# Altium schematic sheet lcd_breakout.SchDoc: Lamp Controller
size A4; SheetNumber: 1; SheetTotal: 1
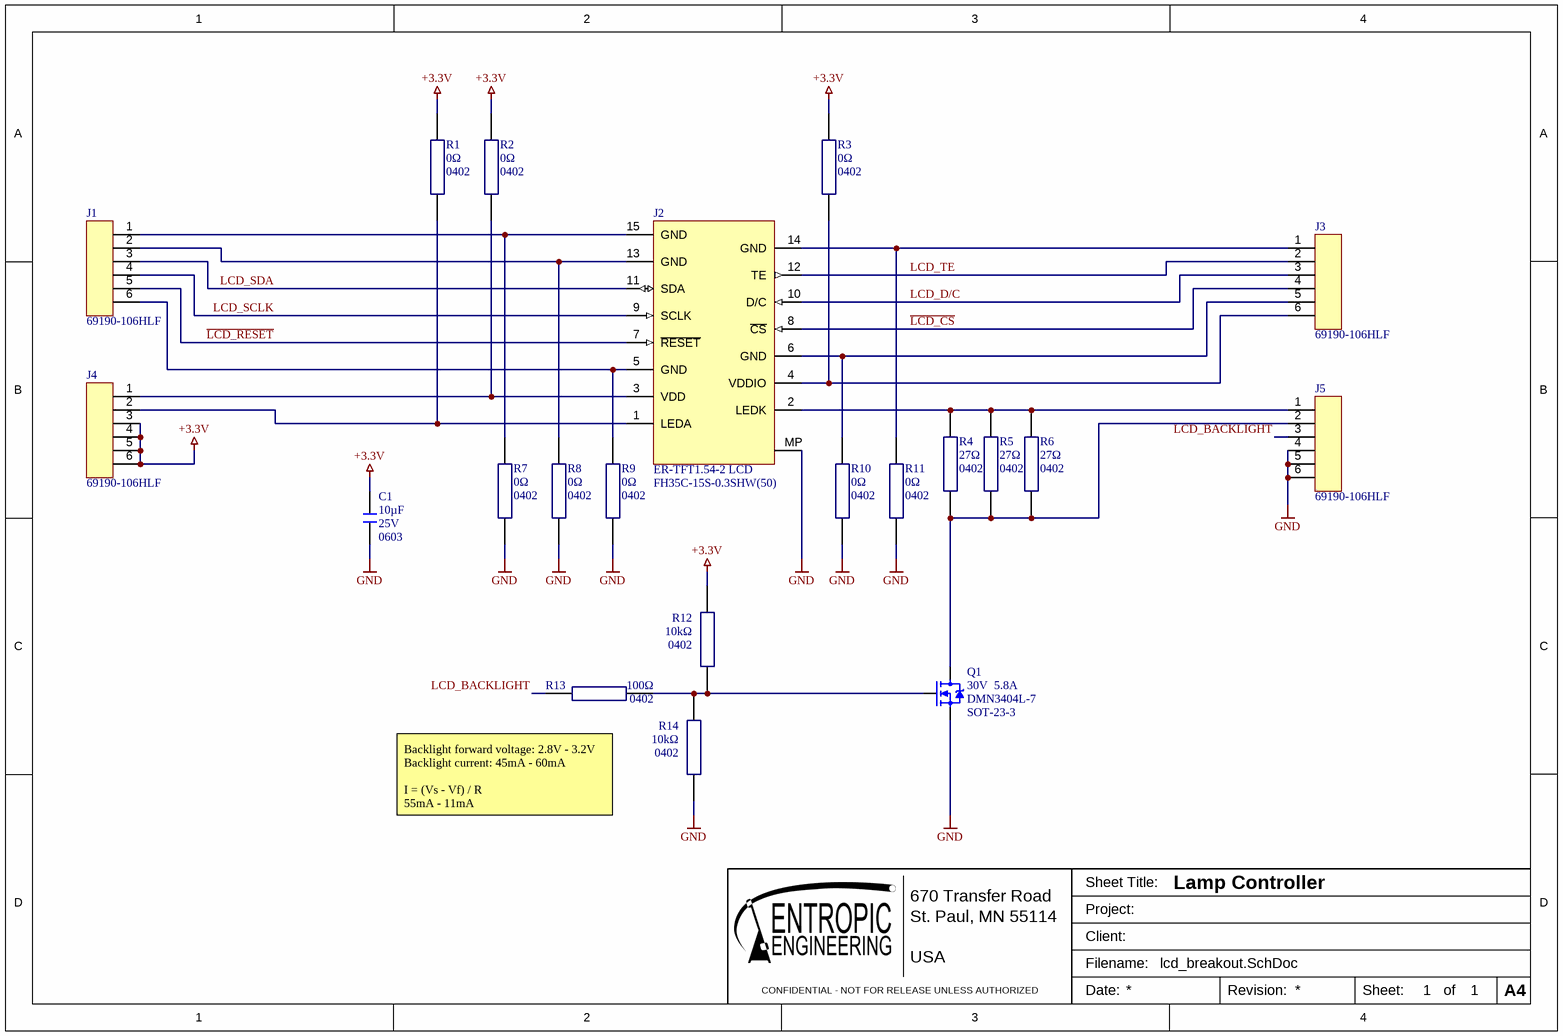
[diagram p0: lcd_breakout.SchDoc]

## Parts
C1  value 10µF  Case/Package: 0603  Voltage Rating: 25V  [0603_capacitor]  (hidden comment: CL10A106MA8NRNC)
J1  *  [69190-106HLF]  (value not drawn)
J2  ER-TFT1.54-2 LCD  [FH35C-15S-0.3SHW(50)]
J3  *  [69190-106HLF]  (value not drawn)
J4  *  [69190-106HLF]  (value not drawn)
J5  *  [69190-106HLF]  (value not drawn)
Q1  DS Breakdown Voltage-Min: 30V  Drain Current-Max (ID): 5.8A  [SOT-23-3]  (hidden comment: DMN3404L-7)
R1  Resistance: 0Ω  Case/Package: 0402  [0402_resistor]  (hidden comment: RMCF0402ZT0R00)
R2  Resistance: 0Ω  Case/Package: 0402  [0402_resistor]  (hidden comment: RMCF0402ZT0R00)
R3  Resistance: 0Ω  Case/Package: 0402  [0402_resistor]  (hidden comment: RMCF0402ZT0R00)
R4  Resistance: 27Ω  Size Code: 0402  [0402_resistor]  (hidden comment: RMCF0402FT27R0)
R5  Resistance: 27Ω  Size Code: 0402  [0402_resistor]  (hidden comment: RMCF0402FT27R0)
R6  Resistance: 27Ω  Size Code: 0402  [0402_resistor]  (hidden comment: RMCF0402FT27R0)
R7  Resistance: 0Ω  Case/Package: 0402  [0402_resistor]  (hidden comment: RMCF0402ZT0R00)
R8  Resistance: 0Ω  Case/Package: 0402  [0402_resistor]  (hidden comment: RMCF0402ZT0R00)
R9  Resistance: 0Ω  Case/Package: 0402  [0402_resistor]  (hidden comment: RMCF0402ZT0R00)
R10  Resistance: 0Ω  Case/Package: 0402  [0402_resistor]  (hidden comment: RMCF0402ZT0R00)
R11  Resistance: 0Ω  Case/Package: 0402  [0402_resistor]  (hidden comment: RMCF0402ZT0R00)
R12  Case Code (Imperial): 0402  Resistance: 10kΩ  [0402_resistor]  (hidden comment: RMCF0402FT10K0)
R13  Case Code (Imperial): 0402  Resistance: 100Ω  [0402_resistor]  (hidden comment: RMCF0402FT100R)
R14  Case Code (Imperial): 0402  Resistance: 10kΩ  [0402_resistor]  (hidden comment: RMCF0402FT10K0)

## Nets
+3.3V: C1.2 J4.3 J4.4 J4.5 J4.6 R1.2 R2.2 R3.2 R12.1
GND: C1.1 J2.MP J5.4 J5.5 J5.6 Q1.2(S) R7.1 R8.1 R9.1 R10.1 R11.1 R14.2
~{LCD_CS}: J2.8(~{CS}) J3.4
~{LCD_RESET}: J1.5 J2.7(~{RESET})
LCD_BACKLIGHT: J5.3 R13.1
LCD_D/C: J2.10(D/C) J3.3
LCD_SCLK: J1.4 J2.9(SCLK)
LCD_SDA: J1.3 J2.11(SDA)
LCD_TE: J2.12(TE) J3.2
NetJ1_1: J1.1 J2.15(GND) R7.2
NetJ1_2: J1.2 J2.13(GND) R8.2
NetJ1_6: J1.6 J2.5(GND) R9.2
NetJ2_1: J2.1(LEDA) J4.2 R1.1
NetJ2_2: J2.2(LEDK) J5.1 R4.1 R5.1 R6.1
NetJ2_3: J2.3(VDD) J4.1 R2.1
NetJ2_4: J2.4(VDDIO) J3.6 R3.1
NetJ2_6: J2.6(GND) J3.5 R10.2
NetJ2_14: J2.14(GND) J3.1 R11.2
NetJ5_2: J5.2 Q1.3(D) R4.2 R5.2 R6.2
NetQ1_1: Q1.1(G) R12.2 R13.2 R14.1

## Notes on the sheet
- (near R13) Backlight forward voltage: 2.8V - 3.2V
  Backlight current: 45mA - 60mA
  I = (Vs - Vf) / R
  55mA - 11mA
- 670 Transfer Road
- St. Paul, MN 55114
- Sheet Title:
- Project:
- CONFIDENTIAL - NOT FOR RELEASE UNLESS AUTHORIZED
- USA
- Client:
- Filename:
- Date:
- Revision:
- Sheet:
- of
- A4

## Library data of the parts
C1 = CL10A106MA8NRNC: 10 µF, 25 V, X5R, 0603 Chip capacitor; Manufacturer: Samsung; house_part_number: C-10uF-0603-002; Tolerance: 20%; Material: 4241ConductorMaterial; RoHS: Yes; Category: Ceramic Capacitors; Case Code (Metric): 1608; Min Operating Temperature: -55°C; Max Operating Temperature: 85°C; Packaging: Cut Tape; RoHS Compliant: Yes; ComponentLink1URL: https://datasheet.ciiva.com/25766/cl10a106ma8nrnc-25766562.pdf?src-supplier=Digikey; ComponentLink1Description: https://datasheet.ciiva.com/25766/cl10a106ma8nrnc-25766562.pdf?src-supplier=Digikey; Manufacturer Part Number: CL10A106MA8NRNC; Case Code (Imperial): 0603; Stock: 632000; Pricing: 4000=0.0511, 8000=0.046, 12000=0.0434, 28000=0.0413, 100000=0.0356 (USD); Mounting Technology: Surface Mount; Series: CL; Height: 900um; Lead Free: Lead Free; Supplier Part Number 1: CL10A106MA8NRNC; Supplier 1: Arrow Electronics
J1 J3-J5 = 69190-106HLF: 6-Pin 0.1" unshrouded header pins; Manufacturer: Amphenol ICC / FCI; Manufacturer Series: 69190; Connector Type: BOARD CONNECTOR; Option: General Purpose; Contact Pattern: RECTANGULAR; Contact Style: SQ PIN-SKT; Filter Feature: No; Number Of Connectors: 1; Number of Contacts: 6; Body Breadth: 0.095inch; Body Depth: 0.1inch; Body Length: 0.6inch; Mounting Option 1: LOCKING; Plating Thickness: 30uin; Reference Standard: UL; Reliability: COMMERCIAL; Supplier 1: Mouser; RoHS: Yes; Category: Connectors; Pricing 1: 1=0.67, 10=0.521, 50=0.521, 100=0.457, 1000=0.343, 10000=0.309 (USD); Mounting Technology: Board; Contact Material: Bronze; Contact Finish - Termination: GOLD (30) OVER NICKEL/NICKEL PALLADIUM GOLD (30) OVER NICKEL; Insulation Color: Black; JESD-609 Code: e4; Contact Gender: Male; Mixed Contacts: No; Mounting Style: STRAIGHT; Number Of PCB Rows: 1; Number of Rows Loaded: 1; PCB Contact Pattern: RECTANGULAR; Termination: Solder; Mating Contact Pitch: 0.1inch; Terminal Length: 0.12inch; Terminal Pitch: 2.54mm; Flammability Rating: UL94 V-0; DIN Conformance: No; IEC Conformance: No; MIL Conformance: No; Reach SVHC Compliant: Yes; RoHS Compliant: Yes; ComponentLink1URL: https://datasheet.ciiva.com/721/69190-721132.pdf?src-supplier=Digikey; ComponentLink1Description: https://datasheet.ciiva.com/721/69190-721132.pdf?src-supplier=Digikey; Supplier Part Number 1: 649-69190-106HLF; Manufacturer Part Number: 69190-106HLF
J2 = LCD Connector: ER-TFT1.54-2 1.54" IPS LCD, 240x240, ST7789 controller, FH35C-15S-0.3SHW(50) connector; Manufacturer: HRS; Connector Type: CARD EDGE CONNECTOR; Contact Pattern: STAGGERED; Contact Resistance: 100mR; Contact Style: BELLOWED TYPE; Dielectric Withstanding Voltage (AC): 90V; Durability: 10Cycles; Insulation Resistance: 50MR; Number Of PCB Rows: 2; Rated Current (Signal): 200mA; Number of Contacts: 15; Body Breadth: 0.035inch; Body Depth: 0.132inch; Body Length: 0.24inch; Mating Contact Pitch: 0.024inch; Mounting Option 1: LOCKING; PCB Contact Row Spacing: 2.8702mm; Reliability: COMMERCIAL; Supplier 1: Digikey; Category: FFC / FPC; Stock 1: 3489; Pricing 1: 1=1.87, 10=1.525, 25=1.4056, 50=1.3216, 100=1.2428, 250=1.14576, 500=1.07746, 1000=1.01326, 2500=0.9375 (USD); Mounting Technology: Board; Contact Material: Bronze; Contact Finish - Mating: AU ON NI; Min Operating Temperature: -55°C; Max Operating Temperature: 85°C; Mounting Style: RIGHT ANGLE; Number of Rows Loaded: 2; PCB Contact Pattern: STAGGERED; Termination: SMD/SMT; Terminal Pitch: 0.6096mm; RoHS Compliant: Yes; ComponentLink1URL: https://datasheet.ciiva.com:443/pdfs/VipMasterIC/IC/HIRO/HIRO-S-A0001800865/HIRO-S-A0001800865-1.pdf?src-supplier=IHS+Markit; ComponentLink1Description: https://datasheet.ciiva.com:443/pdfs/VipMasterIC/IC/HIRO/HIRO-S-A0001800865/HIRO-S-A0001800865-1.pdf?src-supplier=IHS+Markit; ComponentLink2URL: https://datasheet.ciiva.com/29758/ed-fh35c-20140305-29758967.pdf?src-supplier=Digikey; ComponentLink2Description: https://datasheet.ciiva.com/29758/ed-fh35c-20140305-29758967.pdf?src-supplier=Digikey; Supplier Part Number 1: 26-FH35C-15S-0.3SHW(50)CT-ND; Manufacturer Part Number: FH35C-15S-0.3SHW(50)
Q1 = DMN3404L-7: N-FET, 30 V, 5.8 A, SOT-23-3; Manufacturer: Diodes; Package Body Material: Plastic; Transistor Element Material: SILICON; Polarity/Channel Type: N-CHANNEL; Additional Feature: HIGH RELIABILITY; Drain-source On Resistance-Max: 28mR; FET Technology: METAL-OXIDE SEMICONDUCTOR; Number of Elements: 1; Operating Mode: ENHANCEMENT MODE; Power Dissipation-Max (Abs): 1.4W; Pulsed Drain Current-Max (IDM): 30A; Time @ Peak Reflow Temperature-Max (s): 40s; Transistor Application: SWITCHING; Qualification Status: Not Qualified; Supplier 1: Digi-Key; RoHS: Yes; Category: MOSFETs; Stock 1: 150000; Pricing 1: 3000=0.07535, 6000=0.06781, 15000=0.06028, 30000=0.05651, 75000=0.05011, 150000=0.04822 (USD); Pins: 3; Package Shape: Rectangular; Terminal Finish: Tin; Max Operating Temperature: 150°C; JESD-609 Code: e3; Drain Current-Max (Abs) (ID): 5.8A; JESD-30 Code: R-PDSO-G3; Moisture Sensitivity Level: 1; Package Style: SMALL OUTLINEMeter; Peak Reflow Temperature (Cel): 260°C; Surface Mount: Yes; Terminal Form: Gull Wing; Terminal Position: DUAL; Reach SVHC Compliant: Yes; RoHS Compliant: Yes; ComponentLink1URL: https://datasheet.ciiva.com:443/pdfs/VipMasterIC/IC/DIOD/DIODS20277/DIODS20277-1.pdf?src-supplier=IHS+Markit; ComponentLink1Description: https://datasheet.ciiva.com:443/pdfs/VipMasterIC/IC/DIOD/DIODS20277/DIODS20277-1.pdf?src-supplier=IHS+Markit; ComponentLink2URL: https://datasheet.ciiva.com/4444/ds31787-65102-4444489.pdf?src-supplier=Mouser; ComponentLink2Description: https://datasheet.ciiva.com/4444/ds31787-65102-4444489.pdf?src-supplier=Mouser; ComponentLink3URL: https://datasheet.ciiva.com/8115/ds31787-8115384.pdf?src-supplier=Avnet; ComponentLink3Description: https://datasheet.ciiva.com/8115/ds31787-8115384.pdf?src-supplier=Avnet; ComponentLink4URL: https://datasheet.ciiva.com/16508/ds31787-16508477.pdf?src-supplier=Future+Electronics; ComponentLink4Description: https://datasheet.ciiva.com/16508/ds31787-16508477.pdf?src-supplier=Future+Electronics; ComponentLink5URL: https://datasheet.ciiva.com/8023/ds31787-8023981.pdf?src-supplier=Element14; ComponentLink5Description: https://datasheet.ciiva.com/8023/ds31787-8023981.pdf?src-supplier=Element14; ComponentLink6URL: https://datasheet.ciiva.com/934/ds31787-934594.pdf?src-supplier=Digi-Key; ComponentLink6Description: https://datasheet.ciiva.com/934/ds31787-934594.pdf?src-supplier=Digi-Key; ComponentLink7URL: https://datasheet.ciiva.com/934/ds31787-934595.pdf?src-supplier=Digi-Key; ComponentLink7Description: https://datasheet.ciiva.com/934/ds31787-934595.pdf?src-supplier=Digi-Key; ComponentLink8URL: https://datasheet.ciiva.com/934/ds31787-934593.pdf?src-supplier=Digi-Key; ComponentLink8Description: https://datasheet.ciiva.com/934/ds31787-934593.pdf?src-supplier=Digi-Key; Supplier Part Number 1: DMN3404LDITR-ND; Package: SOT-23-3; Manufacturer Part Number: DMN3404L-7
R1-R3 R7-R11 = RMCF0402ZT0R00: 0 Ω, 0402 Jumper; Manufacturer: Stackpole Electronics; house_part_number: JP-0402-001; Power Rating: 63mW; Current Rating: 1A; Working Voltage: 50V; Supplier 1: Digi-Key; Supplier Part Number 1: RMCF0402ZT0R00CT-ND; RoHS: Yes; Category: Chip SMD Resistors; Stock 1: 6500003; Pricing 1: 1=0.10000, 10=0.01000, 25=0.00720, 50=0.00560, 100=0.00410, 250=0.00316, 500=0.00252, 1000=0.00186, 5000=0.00133 (USD); Mount: Surface Mount; Case Code (Metric): 1005; Case Code (Imperial): 0402; Contact Plating: Tin,Matte; Min Operating Temperature: -55°C; Max Operating Temperature: 155°C; Packaging: Tape and Reel; Resistor Type: Thick Film; Number of Terminations: 2; Max Power Dissipation: 63mW; Features: Automotive AEC-Q200; Series: RMCF; Technology: THICK FILM; Construction: Rectangular; Length: 0.039inch; Width: 0.02inch; Height: 0.016inch; Depth: 0.5mm; Radiation Hardening: No; Military Standard: Not; Lead Free: Lead Free; RoHS Compliant: Yes; ComponentLink1URL: https://datasheet.ciiva.com/26835/getdatasheetpartid-409751-26835612.pdf?src-supplier=Verical; ComponentLink1Description: https://datasheet.ciiva.com/26835/getdatasheetpartid-409751-26835612.pdf?src-supplier=Verical; Manufacturer Part Number: RMCF0402ZT0R00
R4-R6 = RMCF0402FT27R0: 27 Ω, 0402 Chip resistor; Manufacturer: Stackpole Electronics; house_part_number: R-27-0402-1%-001; Tolerance: 1%; Rated Power Dissipation (P): 63mW; Rated Temperature: 70°C; Temperature Coefficient: 100ppm/°C; Working Voltage: 50V; Package Height: 0.3mm; Package Length: 1mm; Package Width: 0.5mm; Reference Standard: AEC-Q200; Supplier 1: Digi-Key; Supplier Part Number 1: RMCF0402FT27R0CT-ND; RoHS: Yes; Category: Chip SMD Resistors; Stock 1: 3710; Pricing 1: 1=0.10000, 10=0.01500, 100=0.00610, 1000=0.00274, 2500=0.00238, 5000=0.00197 (USD); Mount: Surface Mount; Number of Pins: 2; Package Shape: Rectangular; Terminal Finish: Nickel; Min Operating Temperature: -55°C; Max Operating Temperature: 155°C; JESD-609 Code: e3; Resistor Type: FIXED RESISTOR; Construction: Rectangular; Package Style: SMTMeter; Packaging: Tape and Reel; Technology: METAL GLAZE/THICK FILM; Termination: Wraparound; REACH SVHC: Yes; RoHS Compliant: Yes; ComponentLink1URL: https://datasheet.ciiva.com:443/pdfs/VipMasterIC/IC/SEIE/SEIE-S-A0009541969/SEIE-S-A0009541969-1.pdf?src-supplier=IHS+Markit; ComponentLink1Description: https://datasheet.ciiva.com:443/pdfs/VipMasterIC/IC/SEIE/SEIE-S-A0009541969/SEIE-S-A0009541969-1.pdf?src-supplier=IHS+Markit; ComponentLink2URL: https://www.seielect.com/catalog/SEI-RMCF_RMCP.pdf?src-supplier=Avnet; ComponentLink2Description: https://www.seielect.com/catalog/SEI-RMCF_RMCP.pdf?src-supplier=Avnet; ComponentLink3URL: https://www.seielect.com/catalog/sei-rmcf_rmcp.pdf?src-supplier=Digi-Key; ComponentLink3Description: https://www.seielect.com/catalog/sei-rmcf_rmcp.pdf?src-supplier=Digi-Key; ComponentLink4URL: http://www.seielect.com/Catalog/SEI-RMCF_RMCP.pdf?src-supplier=Digi-Key; ComponentLink4Description: http://www.seielect.com/Catalog/SEI-RMCF_RMCP.pdf?src-supplier=Digi-Key; Manufacturer Part Number: RMCF0402FT27R0
R12 R14 = RMCF0402FT10K0: 10 kΩ, 0402 Chip resistor; Manufacturer: Stackpole Electronics; house_part_number: R-10k-0402-1%-001; Tolerance: 1%; Power Rating: 62.5mW; Temperature Coefficient: 100ppm/°C; Max Power Dissipation: 63mW; Supplier 1: Digi-Key; Manufacturer Part Number: RMCF0402FT10K0; RoHS: Yes; Category: Chip SMD Resistors; Stock 1: 7219214; Pricing 1: 1=0.10000, 10=0.01300, 100=0.00530, 1000=0.00239, 2500=0.00207, 5000=0.00171 (USD); Mount: Surface Mount; Case/Package: 0402; Case Code (Metric): 1005; Contact Plating: Tin,Matte; Size Code: 0402; Min Operating Temperature: -55°C; Max Operating Temperature: 155°C; Packaging: Tape and Reel; Resistor Type: Thick Film; Number of Terminations: 2; Features: Automotive AEC-Q200; Series: RMCF; Construction: Rectangular; Length: 1mm; Width: 0.02inch; Height: 0.016inch; Depth: 0.5mm; Radiation Hardening: No; Military Standard: Not; Lead Free: Lead Free; RoHS Compliant: Yes; ComponentLink1URL: https://datasheet.ciiva.com/24341/sei-rmcp-24341800.pdf?src-supplier=Onlinecomponents.com; ComponentLink1Description: https://datasheet.ciiva.com/24341/sei-rmcp-24341800.pdf?src-supplier=Onlinecomponents.com; Supplier Part Number 1: RMCF0402FT10K0CT-ND
R13 = RMCF0402FT100R: 100 Ω, 0402 Chip resistor; Manufacturer: Stackpole Electronics; house_part_number: R-100-0402-1%-001; Power Rating: 62.5mW; Tolerance: 1%; Max Power Dissipation: 63mW; Temperature Coefficient: 100ppm/°C; Supplier 1: Digi-Key; Supplier Part Number 1: RMCF0402FT100RCT-ND; RoHS: Yes; Category: Chip SMD Resistors; Stock 1: 188482; Pricing 1: 1=0.10000, 10=0.01300, 100=0.00530, 1000=0.00238, 2500=0.00207, 5000=0.00171 (USD); Mount: Surface Mount; Case/Package: 0402; Case Code (Metric): 1005; Contact Plating: Tin,Matte; Min Operating Temperature: -55°C; Max Operating Temperature: 155°C; Packaging: Tape and Reel; Resistor Type: Thick Film; Number of Terminations: 2; Features: Automotive AEC-Q200; Series: RMCF; Construction: Rectangular; Length: 1mm; Width: 0.02inch; Height: 0.016inch; Depth: 0.5mm; Military Standard: Not; Lead Free: Lead Free; RoHS Compliant: Yes; ComponentLink1URL: http://components.arrow.com/part/dataview/50497758S7215546N1174?src-supplier=Arrow+Electronics; ComponentLink1Description: http://components.arrow.com/part/dataview/50497758S7215546N1174?src-supplier=Arrow+Electronics; ComponentLink2URL: https://www.seielect.com/catalog/sei-rmcf_rmcp.pdf?src-supplier=Digi-Key; ComponentLink2Description: https://www.seielect.com/catalog/sei-rmcf_rmcp.pdf?src-supplier=Digi-Key; ComponentLink3URL: https://www.seielect.com/Catalog/SEI-RMCF_RMCP.pdf?src-supplier=Avnet; ComponentLink3Description: https://www.seielect.com/Catalog/SEI-RMCF_RMCP.pdf?src-supplier=Avnet; ComponentLink4URL: https://www.verical.com/server-webapp/html/getDatasheet?partID=368652&src-supplier=Verical; ComponentLink4Description: https://www.verical.com/server-webapp/html/getDatasheet?partID=368652&src-supplier=Verical; ComponentLink5URL: https://www.seielect.com/Catalog/SEI-RMCF_RMCP.pdf?src-supplier=Avnet+Asia; ComponentLink5Description: https://www.seielect.com/Catalog/SEI-RMCF_RMCP.pdf?src-supplier=Avnet+Asia; Manufacturer Part Number: RMCF0402FT100R